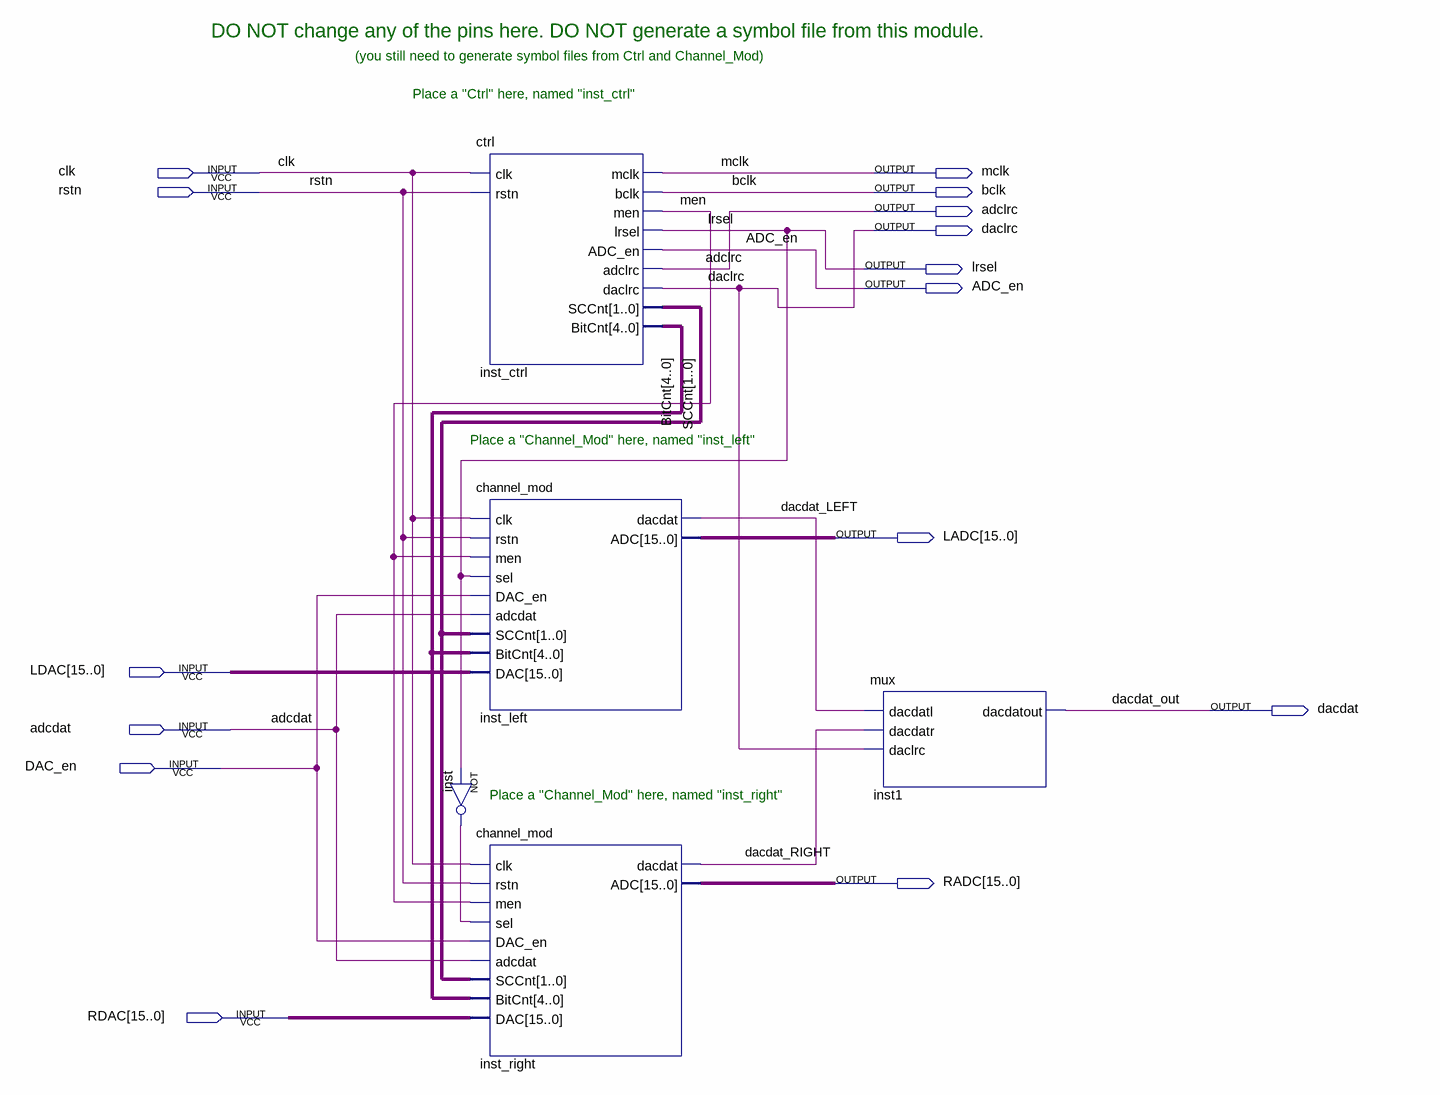
[diagram p0: schematic sheet]
// Quartus schematic SndDriver.bdf as structural Verilog: 5 symbols, 15 pins
module SndDriver (
  input  clk,
  input  rstn,
  input  [15:0] LDAC,
  input  adcdat,
  input  DAC_en,
  input  [15:0] RDAC,
  output mclk,
  output bclk,
  output adclrc,
  output daclrc,
  output lrsel,
  output ADC_en,
  output [15:0] LADC,
  output dacdat,
  output [15:0] RADC
);

  wire dacdat_LEFT, dacdat_RIGHT, inst_out, men;
  wire [1:0] SCCnt;
  wire [4:0] BitCnt;

  ctrl inst_ctrl (
    .clk(clk), .rstn(rstn), .mclk(mclk), .bclk(bclk), .men(men), .lrsel(lrsel), .ADC_en(ADC_en),
    .adclrc(adclrc), .daclrc(daclrc), .SCCnt(SCCnt), .BitCnt(BitCnt));
  channel_mod inst_left (
    .clk(clk), .rstn(rstn), .men(men), .sel(lrsel), .DAC_en(DAC_en), .adcdat(adcdat), .SCCnt(SCCnt),
    .BitCnt(BitCnt), .DAC(LDAC), .dacdat(dacdat_LEFT), .ADC(LADC));
  not inst (inst_out, lrsel);
  channel_mod inst_right (
    .clk(clk), .rstn(rstn), .men(men), .sel(inst_out), .DAC_en(DAC_en), .adcdat(adcdat), .SCCnt(SCCnt),
    .BitCnt(BitCnt), .DAC(RDAC), .dacdat(dacdat_RIGHT), .ADC(RADC));
  mux inst1 (.dacdatl(dacdat_LEFT), .dacdatr(dacdat_RIGHT), .daclrc(daclrc), .dacdatout(dacdat));

  // Other names for the same wires on the sheet: dacdat_out = dacdat

  // Notes on the sheet:
  //   DO NOT change any of the pins here. DO NOT generate a symbol file from this module.
  //   (you still need to generate symbol files from Ctrl and Channel_Mod)
  //   Place a "Ctrl" here, named "inst_ctrl"
  //   Place a "Channel_Mod" here, named "inst_left"
  //   Place a "Channel_Mod" here, named "inst_right"
endmodule
